# EAGLE design source_eagle (EAGLE 9.6.2)
COMPANY: ADAFRUIT INDUSTRIES; DRAWN: KTOWN; REV: A
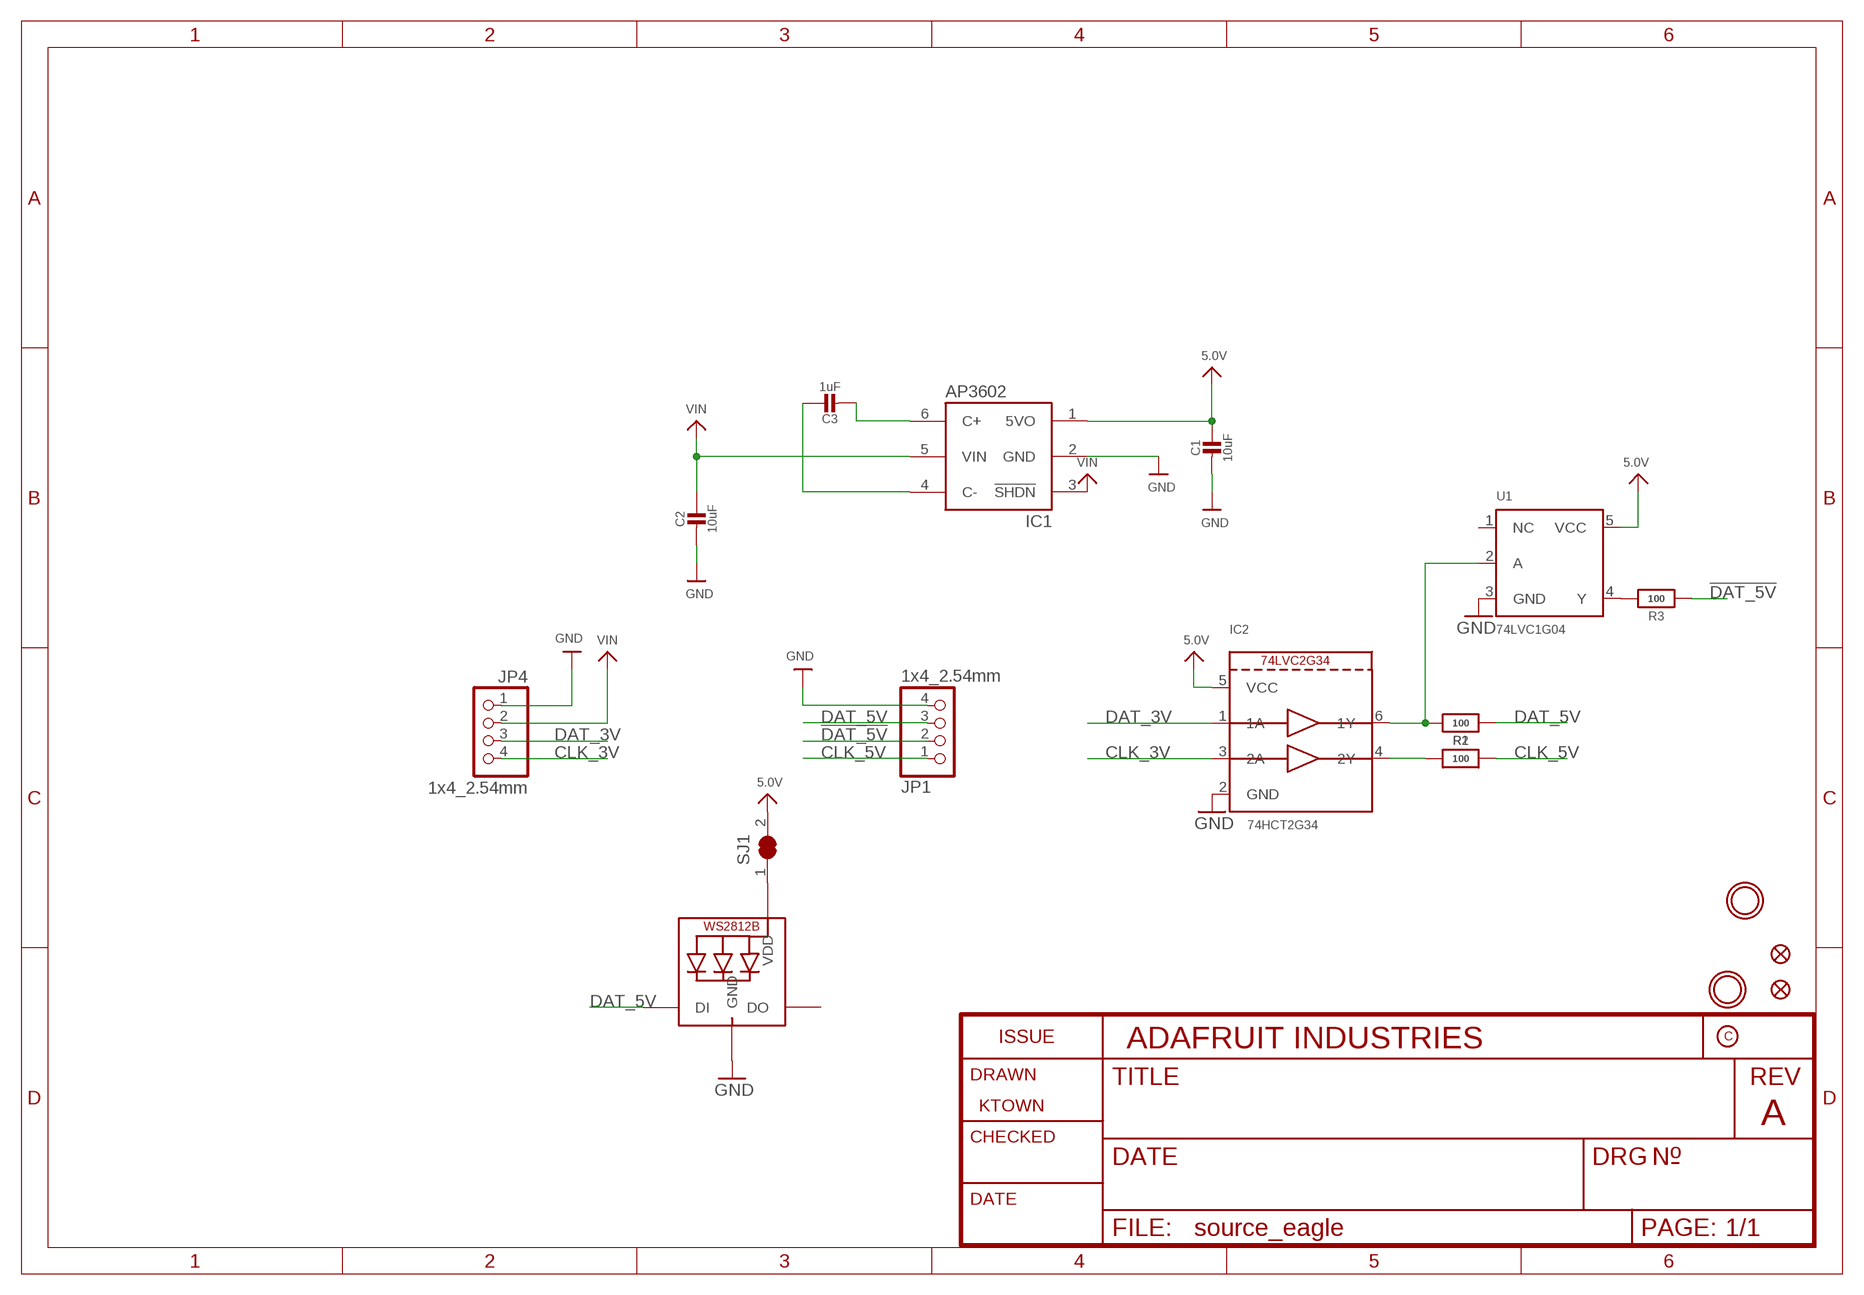
[diagram p0: schematic, sheet 1]

## Parts
C1  10uF  CAP_CERAMIC0805-NOOUTLINE  [0805-NO]
C2  10uF  CAP_CERAMIC0805-NOOUTLINE  [0805-NO]
C3  1uF  CAP_CERAMIC_0603WIDE  [0603-NO_WIDE]
FID1  FIDUCIAL_0.5MM  [FIDUCIAL_0.5MM]
FID2  FIDUCIAL_0.5MM  [FIDUCIAL_0.5MM]
IC1  AP3602  [SOT23-6]
IC2  74HCT2G34  74LVC2G34  [SC70-6L]
JP1  1x4_2.54mm  HEADER-1X4_254MMTERM  [1X04_2.54MMTERMINAL]
JP4  1x4_2.54mm  HEADER-1X4_254MMTERM  [1X04_2.54MMTERMINAL]
LED1  WS2812B_SK6805_1515  [SK6805_1515]
R1  100  RESISTOR_0402NO  [_0402NO]
R2  100  RESISTOR_0402NO  [_0402NO]
R3  100  RESISTOR_0402NO  [_0402NO]
SJ1  SOLDERJUMPER_CLOSED  [SOLDERJUMPER_CLOSEDWIRE]
U1  74LVC1G04  74LVC1G04SC-70  [SC70-5]
U$6  MOUNTINGHOLE2.5  [MOUNTINGHOLE_2.5_PLATED]
U$9  MOUNTINGHOLE2.5  [MOUNTINGHOLE_2.5_PLATED]

## Nets
5.0V: C1.1 IC1.1(5VO) IC2.5(VCC) SJ1.2 U1.5(VCC)
!DAT_5V: JP1.2 R3.2
CLK_3V: IC2.3(2A) JP4.4
CLK_5V: JP1.1 R1.2
DAT_3V: IC2.1(1A) JP4.3
DAT_5V: JP1.3 LED1.1(DI) R2.2
GND: C1.2 C2.2 IC1.2(GND) IC2.2(GND) JP1.4 JP4.1 LED1.4(GND) U1.3(GND)
N$1: C3.2 IC1.6(C+)
N$2: C3.1 IC1.4(C-)
N$3: IC2.4(2Y) R1.1
N$4: R3.1 U1.4(Y)
N$5: IC2.6(1Y) R2.1 U1.2(A)
N$6: LED1.2(VDD) SJ1.1
VIN: C2.1 IC1.3(!SHDN) IC1.5(VIN) JP4.2
Unconnected: LED1.3(DO) U1.1(NC)

## Library data of the parts
C1-C3 = microbuilder:CAP_CERAMIC: Ceramic Capacitors For new designs, use the packages preceded by an '_' character since they are more reliable: The following footprints should be used on most boards: _0402 - Standard footprint for regular board layouts _0603 - Standard footprint for regular board layouts _0805 - Standard footprint for regular board layouts _1206 - Standard footprint for regular board layouts For extremely tight-pitch boards where space is at a premium, the following 'micro-pitch' footprints can be used (smaller pads, no silkscreen outline, etc.): _0402MP - Micro-pitch footprint for very dense/compact boards _0603MP - Micro-pitch footprint for very dense/compact boards _0805MP - Micro-pitch footprint for very dense/compact boards _1206MP - Micro-pitch footprint for very dense/compact boards
FID1 FID2 = microbuilder:FIDUCIAL: Fiducial Alignment Points Various fiducial points for machine vision alignment.
IC1 = microbuilder:AP3602
IC2 = microbuilder:74LVC2G34
JP1 JP4 = microbuilder:HEADER-1X4: PIN HEADER
LED1 = microbuilder:WS2812B; LCSC: C2890035
R1-R3 = microbuilder:RESISTOR: Resistors For new designs, use the packages preceded by an '_' character since they are more reliable: The following footprints should be used on most boards: _0402 - Standard footprint for regular board layouts _0603 - Standard footprint for regular board layouts _0805 - Standard footprint for regular board layouts _1206 - Standard footprint for regular board layouts For extremely tight-pitch boards where space is at a premium, the following 'micro-pitch' footprints can be used (smaller pads, no silkscreen outline, etc.): _0402MP - Micro-pitch footprint for very dense/compact boards _0603MP - Micro-pitch footprint for very dense/compact boards _0805MP - Micro-pitch footprint for very dense/compact boards _1206MP - Micro-pitch footprint for very dense/compact boards
SJ1 = microbuilder:SOLDERJUMPER_CLOSED: Solder Jumper - Closed These solder jumpers are closed by default CLOSEDWIRE - 10 mil trace between pads that can be cut and resoldered later CLOSEDPERM - 63 mil trace between pads for a permanent connection (used to 'bridge' two signals, a shameless hack for Eagle). Can double as a test point as well (no cream layer)
U1 = microbuilder:74LVC1G04: 74LVC1G04 - Single Inverter Gate SOT23-5 SN74LVC1G04DBVR - Digikey: 296-11599-1-ND
U$6 U$9 = adafruit_electromech:MOUNTINGHOLE: Mounting Hole For #2 screws (0.086"/2.18mm width, 0.094"/2.4mm hole) use 2.5mm; BOM: EXCLUDE

## Board
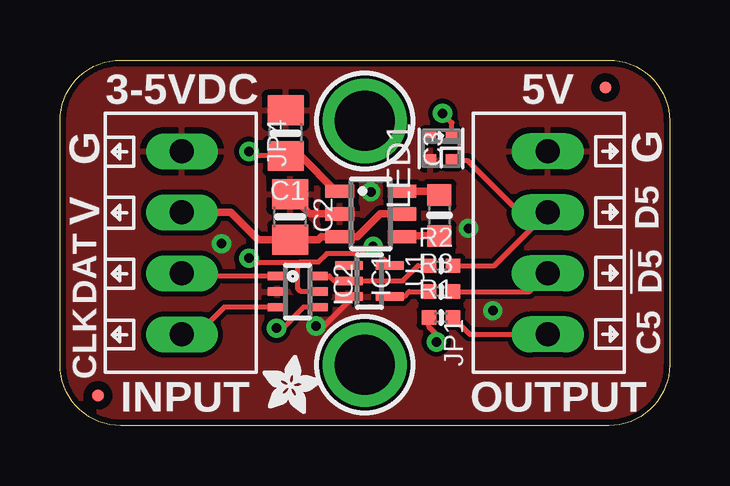
[diagram p1: board, top side]
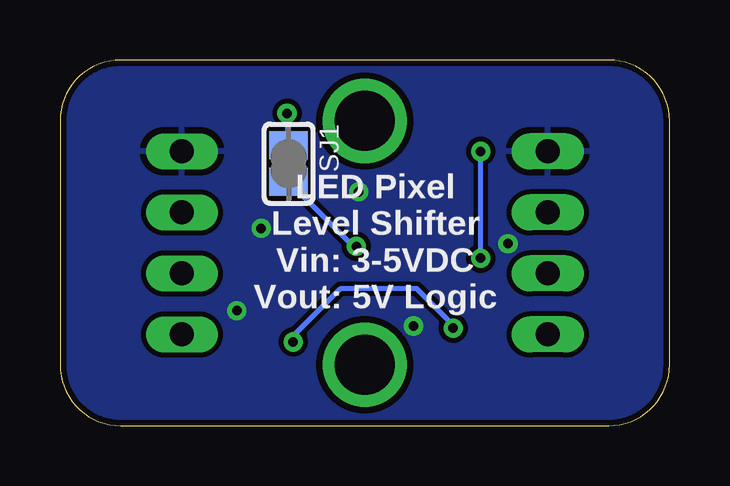
[diagram p2: board, bottom side, seen from below]

Size 25.4 x 15.24 mm. Coordinates in mm from the lower left corner, seen from the top.
Outline: 2.54,15.24 22.86,15.24 arc-90 25.4,12.7 25.4,2.54 arc-90 22.86,0 2.54,0 arc-90 0,2.54 0,12.7 arc-90 2.54,15.24
Copper layers (1*16): Top 0.035mm / dielectric 1.5mm / Bottom 0.035mm
Design rules "adafruit *": minimum track width 8mil, minimum drill 15.5mil, track to track 8mil, track to pad 8mil, pad to pad 8mil, via to via 8mil, smd to smd 8mil, copper to edge 10mil, drill to drill 8mil, minimum pad ring 10mil, minimum via ring 8mil, stop-mask expansion 2mil, vias tented up to drill 20mil, thermal gap 10mil

### Footprints (pad centres in the part's own frame; a part is rotated, then mirrored left to right if it is on the bottom)
0805-NO = smd 1.24 x 1.5: 1 -0.95,0; 2 0.95,0
0603-NO_WIDE = smd 0.9 x 1: 1 -0.85,0; 2 0.85,0
FIDUCIAL_0.5MM = smd 0.5 x 0.5: 1 0,0
SOT23-6 = smd 0.55 x 1.2: 1 -0.95,-1.3; 2 0,-1.3; 3 0.95,-1.3; 4 0.95,1.3; 5 0,1.3; 6 -0.95,1.3
SC70-6L = smd 0.35 x 0.8: 1 -0.65,-0.85; 2 0,-0.85; 3 0.65,-0.85; 4 0.65,0.85; 5 0,0.85; 6 -0.65,0.85
1X04_2.54MMTERMINAL = drill 1 long: 1 -3.81,0; 2 -1.27,0; 3 1.27,0; 4 3.81,0
SK6805_1515 = smd 0.5 x 0.5: 1 -0.5,-0.45; 2 0.5,-0.45; 3 0.5,0.45; 4 -0.5,0.45
_0402NO = smd 0.6 x 0.6: 1 -0.508,0; 2 0.508,0
SOLDERJUMPER_CLOSEDWIRE = smd 1.168 x 1.6: 1 -0.762,0; 2 0.762,0 | smd 0.635 x 0.203: WIRE 0,0
SC70-5 = smd 0.35 x 1.15: 1 -0.65,-0.85; 2 0,-0.85; 3 0.65,-0.85; 4 0.65,0.85; 5 -0.65,0.85
MOUNTINGHOLE_2.5_PLATED = drill 2.5 pad 3.2: P$1 0,0

### Placement (x,y rotation side)
C1  9.4,12.19 90 top
C2  9.59,8.7 90 top
C3  15.81,8.76 90 top
FID1  22.73,14.1 0 top
FID2  1.59,1.27 0 top
IC1  12.95,8.83 270 top
IC2  9.91,5.59 270 top
JP1  20.32,7.62 90 top
JP4  5.08,7.62 270 top
LED1  15.88,11.56 90 top
R1  15.88,4.51 0 top
R2  15.88,6.67 0 top
R3  15.88,5.59 0 top
SJ1  15.88,10.92 270 bottom
U1  12.89,6.03 270 top
U$6  12.7,2.54 0 top
U$9  12.7,12.7 0 top
U$11  [ADAFRUIT_2.5MM]  8.45,0.51 0 top

### Tracks (layer width: path | path; a pad name or v marks a point on that pad's centre or on a via)
5.0V  (via drill 0.39)
  Top 0.203: U1.5 13.25,7.18 13.02,7.18 | 13.02,7.18 11.11,7.18 10.76,6.83 10,6.83 9.97,6.79 | IC2.5 10.03,5.59 9.91,5.71 9.91,6.6 10.1,6.79 9.97,6.79 | 9.97,6.79 8.06,6.79 v7.87,6.99 | C1.1 8.06,11.24 v7.87,11.43 | v13.05,7.47 13.05,7.21 13.02,7.18
  Top 0.305: C1.1 10.03,11.24 11.5,9.78 IC1.1
  Bottom 0.203: v7.87,6.99 v7.87,11.43 | v13.05,7.47 13.19,7.47 SJ1.2
!DAT_5V
  Top 0.203: R3.2 19.56,5.59 JP1.2
CLK_3V
  Top 0.203: IC2.3 6.84,4.94 5.71,3.81 JP4.4
CLK_5V
  Top 0.203: R1.2 17.08,3.81 JP1.1
DAT_3V
  Top 0.203: IC2.1 5.19,6.24 JP4.3
DAT_5V
  Top 0.203: R2.2 18.1,6.67 JP1.3 19.13,8.89 16.96,11.06 LED1.1
GND  (via drill 0.39)
  Top 0.203: U1.3 12.04,5.18 11.02,4.16 v10.67,4.16
  Top 0.305: IC1.2 10.41,8.83 C2.2
  other vias: 12.95,9.75 6.73,7.59 18.03,4.79 17.02,8.22
  pour Bottom: 0,15.24 0,0 25.4,0 25.4,15.24
  pour Top: 0,15.24 0,0 25.4,0 25.4,15.24
N$1
  Top 0.305: C3.2 15.65,9.78 IC1.6
N$2
  Top 0.305: IC1.4 14.76,7.88 14.8,7.91 C3.1
N$3  (via drill 0.39)
  Top 0.203: R1.1 15.37,4.13 15.68,3.81 v15.68,3.49 | IC2.4 10.14,4.94 9.27,4.06 v9.02,4.06
  Bottom 0.203: v9.02,4.06 9.02,4.19 10.54,5.71 13.72,5.71 15.81,3.62 v15.68,3.49
N$4
  Top 0.203: U1.4 14.34,5.38 14.54,5.59 R3.1
N$5
  Top 0.203: IC2.6 11.22,6.24 11.43,6.03 U1.2 14.29,6.03 14.92,6.67 R2.1
N$6  (via drill 0.39)
  Top 0.203: LED1.2 16.32,12.63 v15.94,13.02
  Bottom 0.203: v15.94,13.02 15.94,11.75 SJ1.1
VIN
  Top 0.305: JP4.2 7.11,8.89 8.25,7.75 C2.1 10.77,7.75 10.89,7.88 IC1.3 12.38,7.88 13.34,8.83 IC1.5

### Text on the board
tPlace: 3-5VDC | 5V | G | G | V | D5 | DAT | !D5 | C5 | CLK | INPUT | OUTPUT
bPlace: LED Pixel / Level Shifter / Vin: 3-5VDC / Vout: 5V Logic